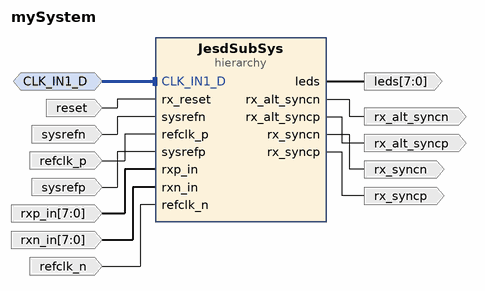
[diagram p0: block diagram of the top level]
# Vivado block design mySystem, Vivado 2016.1
create_bd_design mySystem

create_bd_intf_port -mode Slave -vlnv xilinx.com:interface:diff_clock_rtl:1.0 CLK_IN1_D
set_property -dict {CONFIG.FREQ_HZ 300000000} [get_bd_intf_ports CLK_IN1_D]
create_bd_port -dir I -type rst reset
set_property -dict {CONFIG.POLARITY ACTIVE_HIGH} [get_bd_ports reset]
create_bd_port -dir O -from 7 -to 0 leds
create_bd_port -dir O rx_alt_syncp
create_bd_port -dir O rx_alt_syncn
create_bd_port -dir O rx_syncp
create_bd_port -dir O rx_syncn
create_bd_port -dir I sysrefn
create_bd_port -dir I refclk_p
create_bd_port -dir I sysrefp
create_bd_port -dir I -from 7 -to 0 rxp_in
create_bd_port -dir I -from 7 -to 0 rxn_in
create_bd_port -dir I refclk_n

create_bd_cell -type hier JesdSubSys

# ---- hierarchy /JesdSubSys ----
current_bd_instance /JesdSubSys
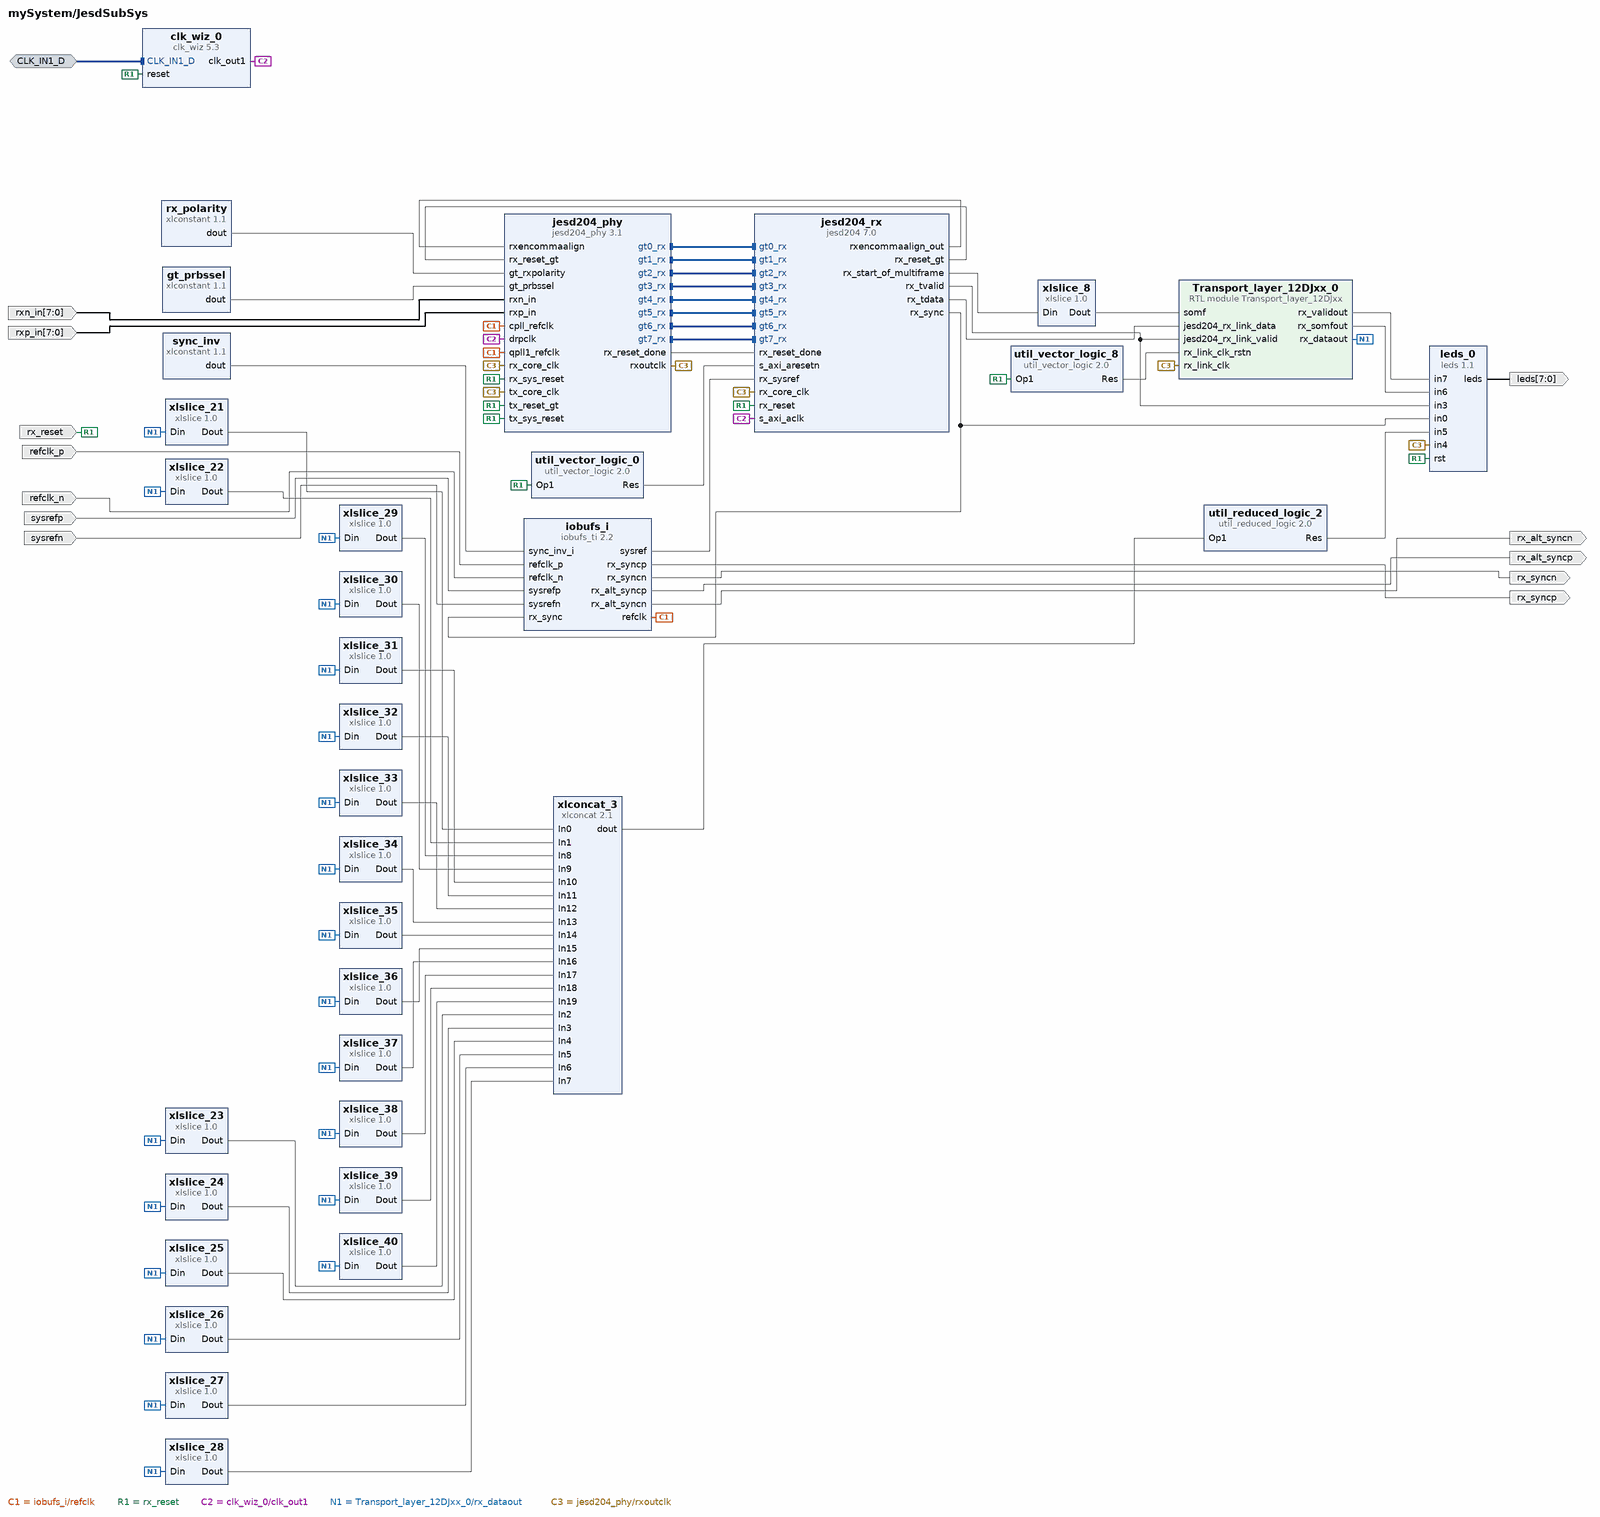
[diagram p1: block diagram inside /JesdSubSys]
create_bd_intf_pin -mode Slave -vlnv xilinx.com:interface:diff_clock_rtl:1.0 CLK_IN1_D
create_bd_pin -dir O -from 7 -to 0 leds
create_bd_pin -dir I refclk_n
create_bd_pin -dir I refclk_p
create_bd_pin -dir I -from 7 -to 0 rxn_in
create_bd_pin -dir I -from 7 -to 0 rxp_in
create_bd_pin -dir O rx_syncn
create_bd_pin -dir O rx_syncp
create_bd_pin -dir O rx_alt_syncn
create_bd_pin -dir O rx_alt_syncp
create_bd_pin -dir I sysrefn
create_bd_pin -dir I sysrefp
create_bd_pin -dir I rx_reset

create_bd_cell -type ip -vlnv xilinx.com:ip:jesd204_phy:3.1 jesd204_phy
set_property -dict [list \
  CONFIG.C_LANES 8 \
  CONFIG.TransceiverControl true \
  CONFIG.GT_Line_Rate 6 \
  CONFIG.GT_REFCLK_FREQ 150 \
  CONFIG.DRPCLK_FREQ 100 \
  CONFIG.C_PLL_SELECTION 2 \
  CONFIG.RX_GT_Line_Rate 6 \
  CONFIG.RX_GT_REFCLK_FREQ 150 \
  CONFIG.RX_PLL_SELECTION 0 \
  CONFIG.Axi_Lite false \
] [get_bd_cells jesd204_phy]
create_bd_cell -type ip -vlnv xilinx.com:ip:jesd204:7.0 jesd204_rx
set_property -dict [list \
  CONFIG.C_NODE_IS_TRANSMIT 0 \
  CONFIG.C_LANES 8 \
  CONFIG.C_DEFAULT_SCR 1 \
  CONFIG.C_DEFAULT_F 8 \
  CONFIG.C_DEFAULT_K 4 \
  CONFIG.AXICLK_FREQ 100.0 \
] [get_bd_cells jesd204_rx]
create_bd_cell -type ip -vlnv xilinx.com:ip:clk_wiz:5.3 clk_wiz_0
set_property -dict [list \
  CONFIG.PRIMITIVE PLL \
  CONFIG.USE_PHASE_ALIGNMENT false \
  CONFIG.PRIM_IN_FREQ 300.000 \
  CONFIG.SECONDARY_SOURCE Single_ended_clock_capable_pin \
  CONFIG.CLKIN1_JITTER_PS 33.330000000000005 \
  CONFIG.CLKOUT2_USED false \
  CONFIG.NUM_OUT_CLKS 1 \
  CONFIG.CLKOUT1_REQUESTED_OUT_FREQ 100 \
  CONFIG.CLKOUT2_REQUESTED_OUT_FREQ 150.000 \
  CONFIG.PRIM_SOURCE Differential_clock_capable_pin \
  CONFIG.CLKOUT1_DRIVES BUFGCE \
  CONFIG.CLKOUT2_DRIVES BUFGCE \
  CONFIG.CLKOUT3_DRIVES BUFGCE \
  CONFIG.CLKOUT4_DRIVES BUFGCE \
  CONFIG.CLKOUT5_DRIVES BUFGCE \
  CONFIG.CLKOUT6_DRIVES BUFGCE \
  CONFIG.CLKOUT7_DRIVES BUFGCE \
  CONFIG.FEEDBACK_SOURCE FDBK_AUTO \
  CONFIG.MMCM_DIVCLK_DIVIDE 1 \
  CONFIG.MMCM_CLKFBOUT_MULT_F 2 \
  CONFIG.MMCM_CLKIN1_PERIOD 3.333 \
  CONFIG.MMCM_COMPENSATION AUTO \
  CONFIG.MMCM_CLKOUT0_DIVIDE_F 6 \
  CONFIG.MMCM_CLKOUT1_DIVIDE 1 \
  CONFIG.USE_SAFE_CLOCK_STARTUP true \
  CONFIG.CLK_IN1_BOARD_INTERFACE default_sysclk_300 \
  CONFIG.CLKOUT1_JITTER 108.112 \
  CONFIG.CLKOUT1_PHASE_ERROR 105.563 \
  CONFIG.CLKOUT2_JITTER 99.774 \
  CONFIG.CLKOUT2_PHASE_ERROR 105.563 \
] [get_bd_cells clk_wiz_0]
create_bd_cell -type ip -vlnv xilinx.com:ip:xlconstant:1.1 rx_polarity
set_property -dict {CONFIG.CONST_WIDTH 8 CONFIG.CONST_VAL 240} [get_bd_cells rx_polarity]
create_bd_cell -type ip -vlnv xilinx.com:ip:xlconstant:1.1 sync_inv
set_property -dict {CONFIG.CONST_WIDTH 1 CONFIG.CONST_VAL 0} [get_bd_cells sync_inv]
create_bd_cell -type ip -vlnv xilinx.com:ip:util_vector_logic:2.0 util_vector_logic_0
set_property -dict {CONFIG.C_SIZE 1 CONFIG.C_OPERATION not} [get_bd_cells util_vector_logic_0]
create_bd_cell -type ip -vlnv xilinx.com:ip:util_vector_logic:2.0 util_vector_logic_8
set_property -dict {CONFIG.C_SIZE 1 CONFIG.C_OPERATION not} [get_bd_cells util_vector_logic_8]
create_bd_cell -type ip -vlnv xilinx.com:ip:xlslice:1.0 xlslice_8
set_property -dict {CONFIG.DOUT_WIDTH 1 CONFIG.DIN_TO 0 CONFIG.DIN_FROM 0 CONFIG.DIN_WIDTH 4} [get_bd_cells xlslice_8]
create_bd_cell -type module -reference Transport_layer_12DJxx Transport_layer_12DJxx_0
create_bd_cell -type ip -vlnv xilinx.com:ip:xlslice:1.0 xlslice_26
set_property -dict {CONFIG.DOUT_WIDTH 12 CONFIG.DIN_TO 60 CONFIG.DIN_FROM 71 CONFIG.DIN_WIDTH 240} [get_bd_cells xlslice_26]
create_bd_cell -type ip -vlnv xilinx.com:ip:xlslice:1.0 xlslice_32
set_property -dict {CONFIG.DOUT_WIDTH 12 CONFIG.DIN_TO 132 CONFIG.DIN_FROM 143 CONFIG.DIN_WIDTH 240} [get_bd_cells xlslice_32]
create_bd_cell -type ip -vlnv xilinx.com:ip:xlslice:1.0 xlslice_27
set_property -dict {CONFIG.DOUT_WIDTH 12 CONFIG.DIN_TO 72 CONFIG.DIN_FROM 83 CONFIG.DIN_WIDTH 240} [get_bd_cells xlslice_27]
create_bd_cell -type ip -vlnv xilinx.com:ip:xlslice:1.0 xlslice_33
set_property -dict {CONFIG.DOUT_WIDTH 12 CONFIG.DIN_TO 144 CONFIG.DIN_FROM 155 CONFIG.DIN_WIDTH 240} [get_bd_cells xlslice_33]
create_bd_cell -type ip -vlnv xilinx.com:ip:xlslice:1.0 xlslice_40
set_property -dict {CONFIG.DOUT_WIDTH 12 CONFIG.DIN_TO 228 CONFIG.DIN_FROM 239 CONFIG.DIN_WIDTH 240} [get_bd_cells xlslice_40]
create_bd_cell -type ip -vlnv xilinx.com:ip:xlslice:1.0 xlslice_28
set_property -dict {CONFIG.DOUT_WIDTH 12 CONFIG.DIN_TO 84 CONFIG.DIN_FROM 95 CONFIG.DIN_WIDTH 240} [get_bd_cells xlslice_28]
create_bd_cell -type ip -vlnv xilinx.com:ip:xlslice:1.0 xlslice_29
set_property -dict {CONFIG.DOUT_WIDTH 12 CONFIG.DIN_TO 96 CONFIG.DIN_FROM 107 CONFIG.DIN_WIDTH 240} [get_bd_cells xlslice_29]
create_bd_cell -type ip -vlnv xilinx.com:ip:xlslice:1.0 xlslice_35
set_property -dict {CONFIG.DOUT_WIDTH 12 CONFIG.DIN_TO 168 CONFIG.DIN_FROM 179 CONFIG.DIN_WIDTH 240} [get_bd_cells xlslice_35]
create_bd_cell -type ip -vlnv xilinx.com:ip:xlslice:1.0 xlslice_36
set_property -dict {CONFIG.DOUT_WIDTH 12 CONFIG.DIN_TO 180 CONFIG.DIN_FROM 191 CONFIG.DIN_WIDTH 240} [get_bd_cells xlslice_36]
create_bd_cell -type ip -vlnv xilinx.com:ip:xlslice:1.0 xlslice_37
set_property -dict {CONFIG.DOUT_WIDTH 12 CONFIG.DIN_TO 192 CONFIG.DIN_FROM 203 CONFIG.DIN_WIDTH 240} [get_bd_cells xlslice_37]
create_bd_cell -type ip -vlnv xilinx.com:ip:xlslice:1.0 xlslice_38
set_property -dict {CONFIG.DOUT_WIDTH 12 CONFIG.DIN_TO 204 CONFIG.DIN_FROM 215 CONFIG.DIN_WIDTH 240} [get_bd_cells xlslice_38]
create_bd_cell -type ip -vlnv xilinx.com:ip:xlslice:1.0 xlslice_39
set_property -dict {CONFIG.DOUT_WIDTH 12 CONFIG.DIN_TO 216 CONFIG.DIN_FROM 227 CONFIG.DIN_WIDTH 240} [get_bd_cells xlslice_39]
create_bd_cell -type ip -vlnv xilinx.com:ip:xlslice:1.0 xlslice_21
set_property -dict {CONFIG.DOUT_WIDTH 12 CONFIG.DIN_TO 0 CONFIG.DIN_FROM 11 CONFIG.DIN_WIDTH 240} [get_bd_cells xlslice_21]
create_bd_cell -type ip -vlnv xilinx.com:ip:xlslice:1.0 xlslice_22
set_property -dict {CONFIG.DOUT_WIDTH 12 CONFIG.DIN_TO 12 CONFIG.DIN_FROM 23 CONFIG.DIN_WIDTH 240} [get_bd_cells xlslice_22]
create_bd_cell -type ip -vlnv xilinx.com:ip:xlslice:1.0 xlslice_23
set_property -dict {CONFIG.DOUT_WIDTH 12 CONFIG.DIN_TO 24 CONFIG.DIN_FROM 35 CONFIG.DIN_WIDTH 240} [get_bd_cells xlslice_23]
create_bd_cell -type ip -vlnv xilinx.com:ip:xlslice:1.0 xlslice_24
set_property -dict {CONFIG.DOUT_WIDTH 12 CONFIG.DIN_TO 36 CONFIG.DIN_FROM 47 CONFIG.DIN_WIDTH 240} [get_bd_cells xlslice_24]
create_bd_cell -type ip -vlnv xilinx.com:ip:xlslice:1.0 xlslice_30
set_property -dict {CONFIG.DOUT_WIDTH 12 CONFIG.DIN_TO 108 CONFIG.DIN_FROM 119 CONFIG.DIN_WIDTH 240} [get_bd_cells xlslice_30]
create_bd_cell -type ip -vlnv xilinx.com:ip:xlslice:1.0 xlslice_31
set_property -dict {CONFIG.DOUT_WIDTH 12 CONFIG.DIN_TO 120 CONFIG.DIN_FROM 131 CONFIG.DIN_WIDTH 240} [get_bd_cells xlslice_31]
create_bd_cell -type ip -vlnv xilinx.com:ip:xlslice:1.0 xlslice_25
set_property -dict {CONFIG.DOUT_WIDTH 12 CONFIG.DIN_TO 48 CONFIG.DIN_FROM 59 CONFIG.DIN_WIDTH 240} [get_bd_cells xlslice_25]
create_bd_cell -type ip -vlnv xilinx.com:ip:xlslice:1.0 xlslice_34
set_property -dict {CONFIG.DOUT_WIDTH 12 CONFIG.DIN_TO 156 CONFIG.DIN_FROM 167 CONFIG.DIN_WIDTH 240} [get_bd_cells xlslice_34]
create_bd_cell -type ip -vlnv xilinx.com:ip:xlconcat:2.1 xlconcat_3
set_property -dict [list \
  CONFIG.NUM_PORTS 20 \
  CONFIG.IN0_WIDTH 12 \
  CONFIG.IN1_WIDTH 12 \
  CONFIG.IN2_WIDTH 12 \
  CONFIG.IN3_WIDTH 12 \
  CONFIG.IN4_WIDTH 12 \
  CONFIG.IN5_WIDTH 12 \
  CONFIG.IN6_WIDTH 12 \
  CONFIG.IN7_WIDTH 12 \
  CONFIG.IN8_WIDTH 12 \
  CONFIG.IN9_WIDTH 12 \
  CONFIG.IN10_WIDTH 12 \
  CONFIG.IN11_WIDTH 12 \
  CONFIG.IN12_WIDTH 12 \
  CONFIG.IN13_WIDTH 12 \
  CONFIG.IN14_WIDTH 12 \
  CONFIG.IN15_WIDTH 12 \
  CONFIG.IN16_WIDTH 12 \
  CONFIG.IN17_WIDTH 12 \
  CONFIG.IN18_WIDTH 12 \
  CONFIG.IN19_WIDTH 12 \
] [get_bd_cells xlconcat_3]
create_bd_cell -type ip -vlnv xilinx.com:ip:util_reduced_logic:2.0 util_reduced_logic_2
set_property -dict {CONFIG.C_SIZE 240 CONFIG.C_OPERATION and} [get_bd_cells util_reduced_logic_2]
create_bd_cell -type ip -vlnv user.org:user:iobufs_ti:2.2 iobufs_i
create_bd_cell -type ip -vlnv user.org:user:leds:1.1 leds_0
set_property -dict {CONFIG.CNFG 120} [get_bd_cells leds_0]
create_bd_cell -type ip -vlnv xilinx.com:ip:xlconstant:1.1 gt_prbssel
set_property -dict {CONFIG.CONST_WIDTH 4 CONFIG.CONST_VAL 0} [get_bd_cells gt_prbssel]

# ---- connections ----

current_bd_instance /JesdSubSys
connect_bd_intf_net [get_bd_intf_pins jesd204_phy/gt0_rx] [get_bd_intf_pins jesd204_rx/gt0_rx]
connect_bd_intf_net [get_bd_intf_pins jesd204_phy/gt1_rx] [get_bd_intf_pins jesd204_rx/gt1_rx]
connect_bd_intf_net [get_bd_intf_pins jesd204_phy/gt2_rx] [get_bd_intf_pins jesd204_rx/gt2_rx]
connect_bd_intf_net [get_bd_intf_pins jesd204_phy/gt3_rx] [get_bd_intf_pins jesd204_rx/gt3_rx]
connect_bd_intf_net [get_bd_intf_pins jesd204_phy/gt4_rx] [get_bd_intf_pins jesd204_rx/gt4_rx]
connect_bd_intf_net [get_bd_intf_pins jesd204_phy/gt5_rx] [get_bd_intf_pins jesd204_rx/gt5_rx]
connect_bd_intf_net [get_bd_intf_pins jesd204_phy/gt6_rx] [get_bd_intf_pins jesd204_rx/gt6_rx]
connect_bd_intf_net [get_bd_intf_pins jesd204_phy/gt7_rx] [get_bd_intf_pins jesd204_rx/gt7_rx]
connect_bd_intf_net [get_bd_intf_pins CLK_IN1_D] [get_bd_intf_pins clk_wiz_0/CLK_IN1_D]
connect_bd_net [get_bd_pins jesd204_phy/rx_reset_done] [get_bd_pins jesd204_rx/rx_reset_done]
connect_bd_net [get_bd_pins jesd204_rx/rx_sync] [get_bd_pins iobufs_i/rx_sync] [get_bd_pins leds_0/in0]
connect_bd_net [get_bd_pins jesd204_rx/rxencommaalign_out] [get_bd_pins jesd204_phy/rxencommaalign]
connect_bd_net -net jesd_data_if_0_refclk [get_bd_pins iobufs_i/refclk] [get_bd_pins jesd204_phy/cpll_refclk] [get_bd_pins jesd204_phy/qpll1_refclk]
connect_bd_net -net jesd_data_if_0_sysref [get_bd_pins iobufs_i/sysref] [get_bd_pins jesd204_rx/rx_sysref]
connect_bd_net [get_bd_pins leds_0/leds] [get_bd_pins leds]
connect_bd_net [get_bd_pins rxn_in] [get_bd_pins jesd204_phy/rxn_in]
connect_bd_net [get_bd_pins rxp_in] [get_bd_pins jesd204_phy/rxp_in]
connect_bd_net [get_bd_pins refclk_p] [get_bd_pins iobufs_i/refclk_p]
connect_bd_net [get_bd_pins refclk_n] [get_bd_pins iobufs_i/refclk_n]
connect_bd_net [get_bd_pins sysrefp] [get_bd_pins iobufs_i/sysrefp]
connect_bd_net [get_bd_pins sysrefn] [get_bd_pins iobufs_i/sysrefn]
connect_bd_net [get_bd_pins iobufs_i/rx_syncp] [get_bd_pins rx_syncp]
connect_bd_net [get_bd_pins iobufs_i/rx_syncn] [get_bd_pins rx_syncn]
connect_bd_net [get_bd_pins iobufs_i/rx_alt_syncp] [get_bd_pins rx_alt_syncp]
connect_bd_net [get_bd_pins iobufs_i/rx_alt_syncn] [get_bd_pins rx_alt_syncn]
connect_bd_net [get_bd_pins jesd204_rx/rx_tvalid] [get_bd_pins Transport_layer_12DJxx_0/jesd204_rx_link_valid] [get_bd_pins leds_0/in3]
connect_bd_net [get_bd_pins rx_reset] \
  [get_bd_pins jesd204_rx/rx_reset] [get_bd_pins jesd204_phy/rx_sys_reset] [get_bd_pins jesd204_phy/tx_reset_gt] \
  [get_bd_pins jesd204_phy/tx_sys_reset] [get_bd_pins clk_wiz_0/reset] [get_bd_pins util_vector_logic_0/Op1] \
  [get_bd_pins util_vector_logic_8/Op1] [get_bd_pins leds_0/rst]
connect_bd_net -net xlconstant_0_dout [get_bd_pins rx_polarity/dout] [get_bd_pins jesd204_phy/gt_rxpolarity]
connect_bd_net [get_bd_pins clk_wiz_0/clk_out1] [get_bd_pins jesd204_phy/drpclk] [get_bd_pins jesd204_rx/s_axi_aclk]
connect_bd_net [get_bd_pins jesd204_rx/rx_tdata] [get_bd_pins Transport_layer_12DJxx_0/jesd204_rx_link_data]
connect_bd_net [get_bd_pins util_vector_logic_0/Res] [get_bd_pins jesd204_rx/s_axi_aresetn]
connect_bd_net [get_bd_pins jesd204_rx/rx_reset_gt] [get_bd_pins jesd204_phy/rx_reset_gt]
connect_bd_net [get_bd_pins util_vector_logic_8/Res] [get_bd_pins Transport_layer_12DJxx_0/rx_link_clk_rstn]
connect_bd_net [get_bd_pins Transport_layer_12DJxx_0/rx_validout] [get_bd_pins leds_0/in7]
connect_bd_net [get_bd_pins Transport_layer_12DJxx_0/rx_dataout] \
  [get_bd_pins xlslice_32/Din] [get_bd_pins xlslice_35/Din] [get_bd_pins xlslice_36/Din] [get_bd_pins xlslice_23/Din] \
  [get_bd_pins xlslice_28/Din] [get_bd_pins xlslice_31/Din] [get_bd_pins xlslice_39/Din] [get_bd_pins xlslice_40/Din] \
  [get_bd_pins xlslice_37/Din] [get_bd_pins xlslice_38/Din] [get_bd_pins xlslice_21/Din] [get_bd_pins xlslice_22/Din] \
  [get_bd_pins xlslice_29/Din] [get_bd_pins xlslice_30/Din] [get_bd_pins xlslice_33/Din] [get_bd_pins xlslice_34/Din] \
  [get_bd_pins xlslice_25/Din] [get_bd_pins xlslice_27/Din] [get_bd_pins xlslice_24/Din] [get_bd_pins xlslice_26/Din]
connect_bd_net -net xlconstant_1_dout [get_bd_pins sync_inv/dout] [get_bd_pins iobufs_i/sync_inv_i]
connect_bd_net [get_bd_pins jesd204_rx/rx_start_of_multiframe] [get_bd_pins xlslice_8/Din]
connect_bd_net -net rx_somf [get_bd_pins xlslice_8/Dout] [get_bd_pins Transport_layer_12DJxx_0/somf]
connect_bd_net [get_bd_pins Transport_layer_12DJxx_0/rx_somfout] [get_bd_pins leds_0/in6]
connect_bd_net [get_bd_pins jesd204_phy/rxoutclk] \
  [get_bd_pins jesd204_rx/rx_core_clk] [get_bd_pins jesd204_phy/rx_core_clk] [get_bd_pins jesd204_phy/tx_core_clk] \
  [get_bd_pins Transport_layer_12DJxx_0/rx_link_clk] [get_bd_pins leds_0/in4]
connect_bd_net -net Transport_smpl_0 [get_bd_pins xlslice_21/Dout] [get_bd_pins xlconcat_3/In0]
connect_bd_net -net Transport_smpl_1 [get_bd_pins xlslice_22/Dout] [get_bd_pins xlconcat_3/In1]
connect_bd_net -net Transport_smpl_2 [get_bd_pins xlslice_23/Dout] [get_bd_pins xlconcat_3/In2]
connect_bd_net -net Transport_smpl_3 [get_bd_pins xlslice_24/Dout] [get_bd_pins xlconcat_3/In3]
connect_bd_net -net Transport_smpl_4 [get_bd_pins xlslice_25/Dout] [get_bd_pins xlconcat_3/In4]
connect_bd_net -net Transport_smpl_5 [get_bd_pins xlslice_26/Dout] [get_bd_pins xlconcat_3/In5]
connect_bd_net -net Transport_smpl_6 [get_bd_pins xlslice_27/Dout] [get_bd_pins xlconcat_3/In6]
connect_bd_net -net Transport_smpl_7 [get_bd_pins xlslice_28/Dout] [get_bd_pins xlconcat_3/In7]
connect_bd_net -net Transport_smpl_8 [get_bd_pins xlslice_29/Dout] [get_bd_pins xlconcat_3/In8]
connect_bd_net -net Transport_smpl_9 [get_bd_pins xlslice_30/Dout] [get_bd_pins xlconcat_3/In9]
connect_bd_net -net Transport_smpl_10 [get_bd_pins xlslice_31/Dout] [get_bd_pins xlconcat_3/In10]
connect_bd_net -net Transport_smpl_11 [get_bd_pins xlslice_32/Dout] [get_bd_pins xlconcat_3/In11]
connect_bd_net -net Transport_smpl_12 [get_bd_pins xlslice_33/Dout] [get_bd_pins xlconcat_3/In12]
connect_bd_net -net Transport_smpl_13 [get_bd_pins xlslice_34/Dout] [get_bd_pins xlconcat_3/In13]
connect_bd_net -net Transport_smpl_14 [get_bd_pins xlslice_35/Dout] [get_bd_pins xlconcat_3/In14]
connect_bd_net -net Transport_smpl_15 [get_bd_pins xlslice_36/Dout] [get_bd_pins xlconcat_3/In15]
connect_bd_net -net Transport_smpl_16 [get_bd_pins xlslice_37/Dout] [get_bd_pins xlconcat_3/In16]
connect_bd_net -net Transport_smpl_17 [get_bd_pins xlslice_38/Dout] [get_bd_pins xlconcat_3/In17]
connect_bd_net -net Transport_smpl_18 [get_bd_pins xlslice_39/Dout] [get_bd_pins xlconcat_3/In18]
connect_bd_net -net Transport_smpl_19 [get_bd_pins xlslice_40/Dout] [get_bd_pins xlconcat_3/In19]
connect_bd_net [get_bd_pins xlconcat_3/dout] [get_bd_pins util_reduced_logic_2/Op1]
connect_bd_net [get_bd_pins util_reduced_logic_2/Res] [get_bd_pins leds_0/in5]
connect_bd_net [get_bd_pins gt_prbssel/dout] [get_bd_pins jesd204_phy/gt_prbssel]

current_bd_instance /
connect_bd_intf_net [get_bd_intf_ports CLK_IN1_D] [get_bd_intf_pins JesdSubSys/CLK_IN1_D]
connect_bd_net [get_bd_ports reset] [get_bd_pins JesdSubSys/rx_reset]
connect_bd_net [get_bd_pins JesdSubSys/leds] [get_bd_ports leds]
connect_bd_net [get_bd_pins JesdSubSys/rx_alt_syncp] [get_bd_ports rx_alt_syncp]
connect_bd_net [get_bd_pins JesdSubSys/rx_alt_syncn] [get_bd_ports rx_alt_syncn]
connect_bd_net [get_bd_pins JesdSubSys/rx_syncp] [get_bd_ports rx_syncp]
connect_bd_net [get_bd_pins JesdSubSys/rx_syncn] [get_bd_ports rx_syncn]
connect_bd_net [get_bd_ports sysrefn] [get_bd_pins JesdSubSys/sysrefn]
connect_bd_net [get_bd_ports refclk_p] [get_bd_pins JesdSubSys/refclk_p]
connect_bd_net [get_bd_ports sysrefp] [get_bd_pins JesdSubSys/sysrefp]
connect_bd_net [get_bd_ports rxp_in] [get_bd_pins JesdSubSys/rxp_in]
connect_bd_net [get_bd_ports rxn_in] [get_bd_pins JesdSubSys/rxn_in]
connect_bd_net [get_bd_ports refclk_n] [get_bd_pins JesdSubSys/refclk_n]

validate_bd_design
save_bd_design
